# Altium schematic sheet [11]- Power Input and Regulators.SchDoc
size A4
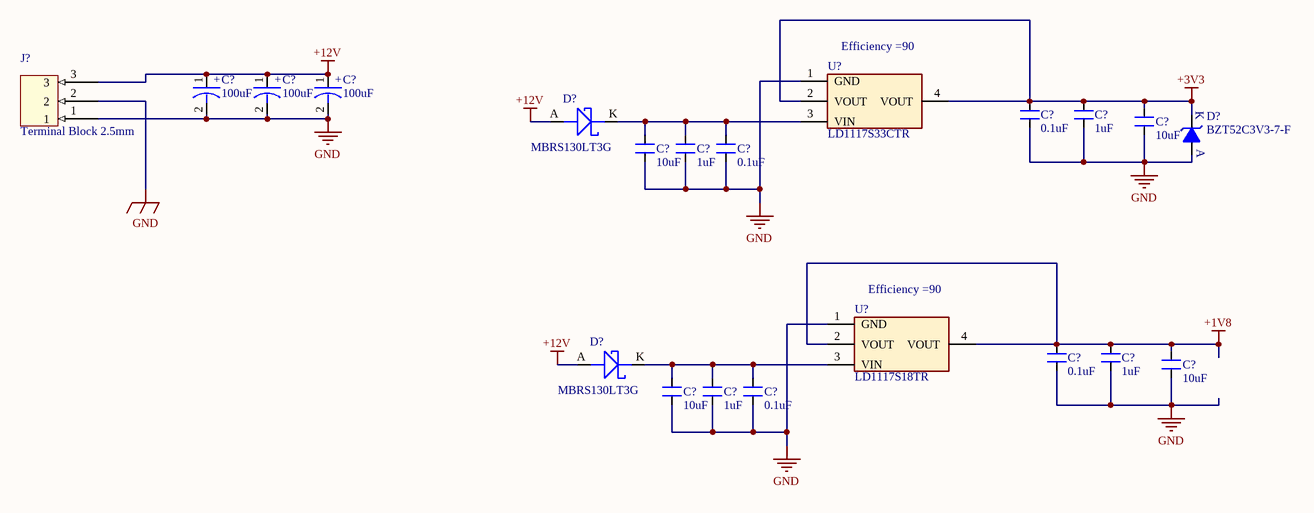
[diagram p0: [11]- Power Input and Regulators.SchDoc]

## Parts
(Parts that share a designator on the sheet are numbered #1, #2 ... from top to bottom, then left to right.)
C?#1  100uF  [ACAP_P305_D393_H393_RAD]
C?#2  100uF  [ACAP_P305_D393_H393_RAD]
C?#3  100uF  [ACAP_P305_D393_H393_RAD]
C?#4  0.1uF  [CAP_0805]
C?#5  1uF  [CAP_0805]
C?#6  10uF  [CAP_1206]
C?#7  10uF  [CAP_1206]
C?#8  1uF  [CAP_0805]
C?#9  0.1uF  [CAP_0805]
C?#10  0.1uF  [CAP_0805]
C?#11  1uF  [CAP_0805]
C?#12  10uF  [CAP_1206]
C?#13  10uF  [CAP_1206]
C?#14  1uF  [CAP_0805]
C?#15  0.1uF  [CAP_0805]
D?#1  MBRS130LT3G  [DIO_SMB_DO-214AA]
D?#2  BZT52C3V3-7-F  [DIO_SOD-123]
D?#3  MBRS130LT3G  [DIO_SMB_DO-214AA]
J?  Terminal Block 2.5mm  [CON3_100_TB_TH_ST]
U?#1  LD1117S33CTR  [SOT223_3]
U?#2  LD1117S18TR  [SOT223_3]

## Nets
+1V8: C?#10.2 C?#11.2 C?#12.2 U?#2.2(VOUT) U?#2.4(VOUT)
+3V3: C?#4.2 C?#5.2 C?#6.2 D?#2.K U?#1.2(VOUT) U?#1.4(VOUT)
+12V: C?#1.1 C?#2.1 C?#3.1 D?#1.A D?#3.A J?.3
GND: C?#1.2 C?#2.2 C?#3.2 C?#4.1 C?#5.1 C?#6.1 C?#7.1 C?#8.1 C?#9.1 C?#10.1 C?#11.1 C?#12.1 C?#13.1 C?#14.1 C?#15.1 D?#2.A J?.1 J?.2 U?#1.1(GND) U?#2.1(GND)
NetC?#7_2: C?#7.2 C?#8.2 C?#9.2 D?#1.K U?#1.3(VIN)
NetC?#13_2: C?#13.2 C?#14.2 C?#15.2 D?#3.K U?#2.3(VIN)

## Notes on the sheet
- (near U?#1) Efficiency =90
- (near U?#2) Efficiency =90
- (in symbol CAP-P_100uF-50V-20%-RAD) +

## Library data of the parts
C?#1-C?#3 = CAP-P_100uF-50V-20%-RAD: 100µF 50V Aluminum Polymer Capacitor Radial, Can - SMD 28mOhm 4000 Hrs @ 125°C /; Manufacturer: Nichicon; Manufacturer Part Number: GYA1H101MCQ1GS; Alternate Part Number-1: VEU101M1HTR-1010; Case/Package: Radial-SMD; Supplier-1: SP ROAD; Supplier Part Number-1: GYA1H101MCQ1GS
C?#4 C?#9 C?#10 C?#15 = CAP_0.1uF-50V-10%-0805: 0.1µF ±10% 50V Ceramic Capacitor X7R 0805 (2012 Metric) /; Manufacturer: Samsung; Manufacturer Part Number: CL21B104KBCNNNC; Alternate Part Number-1: NA; Case/Package: 0805; Supplier-1: SIRICOM; Supplier Part Number-1: 0805B104K500CT
C?#5 C?#8 C?#11 C?#14 = CAP_1uF-50V-5%-0805: 1µF ±5% 50V Ceramic Capacitor X7R 0805 (2012 Metric) /; Manufacturer: Samsung; Manufacturer Part Number: CC0805JKX7R9BB105; Alternate Part Number-1: 0805F105M500NT; Case/Package: 0805; Supplier-1: SIRICOM; Supplier Part Number-1: CL21B105KBFNNNE
C?#6 C?#7 C?#12 C?#13 = CAP_10uF-50V-10%-1206: 10µF ±10% 50V Ceramic Capacitor X7R 1206 (3216 Metric) /; Manufacturer: KEMET; Manufacturer Part Number: CL31B106KBHNNNE; Alternate Part Number-1: GRT31CR61H106ME01L; Case/Package: 1206; Supplier-1: SIRICOM; Supplier Part Number-1: CC1206KKX5R9BB106
D?#1 D?#3 = DIO-S_445mV-30V-2A-SMB: Diode Schottky 30V 2A Surface Mount SMB; Manufacturer: ON Semiconductor; Alternate Part Number-1: NA; Manufacturer Part Number: MBRS130LT3G; Case/Package: SMB; Supplier-1: ARROW; Supplier Part Number-1: MBRS130LT3G
D?#2 = DIO-Z_3.3V-500mW-SOD123: Zener Diode 3.3V 500mW ±6% Surface Mount SOD-123 /; Manufacturer: Diodes Incorporated; Alternate Part Number-1: NA; Manufacturer Part Number: BZT52C3V3-7-F; Case/Package: SOD-123; Supplier-1: Digikey; Supplier Part Number-1: BZT52C3V3-FDICT-ND
J? = CON-TB_3X1-100-ST-TH: 3 Pins, 1 Row 2.54mm Pitch, straight Connector, male; Manufacturer Part Number: 1725669; Manufacturer: Phoenix Contact; Alternate Part Number-1: NA; Case/Package: TH-CON; Supplier-1: SP ROAD; Supplier Part Number-1: 1725669
U?#1 = REG_15V-3.3V-0.9A-12W-SOT223: Linear Voltage Regulator IC 1 Output 800mA SOT-223; Manufacturer: STMicroelectronics; Alternate Part Number-1: NA; Manufacturer Part Number: LD1117S33CTR; Case/Package: SOT223; Supplier-1: SP ROAD; Supplier Part Number-1: LD1117S33CTR
U?#2 = REG_15V-1.8V-0.8A-1.4W-SOT223: LDO Voltage Regulators 1.8V 0.8A Positive; Manufacturer: STMicroelectronics; Alternate Part Number-1: NA; Manufacturer Part Number: LD1117S18TR; Case/Package: SOT-223-3; Supplier-1: Mouser; Supplier Part Number-1: 511-LD1117S18-TR